# EAGLE design SixPotatoeV6 (EAGLE 9.6.0)
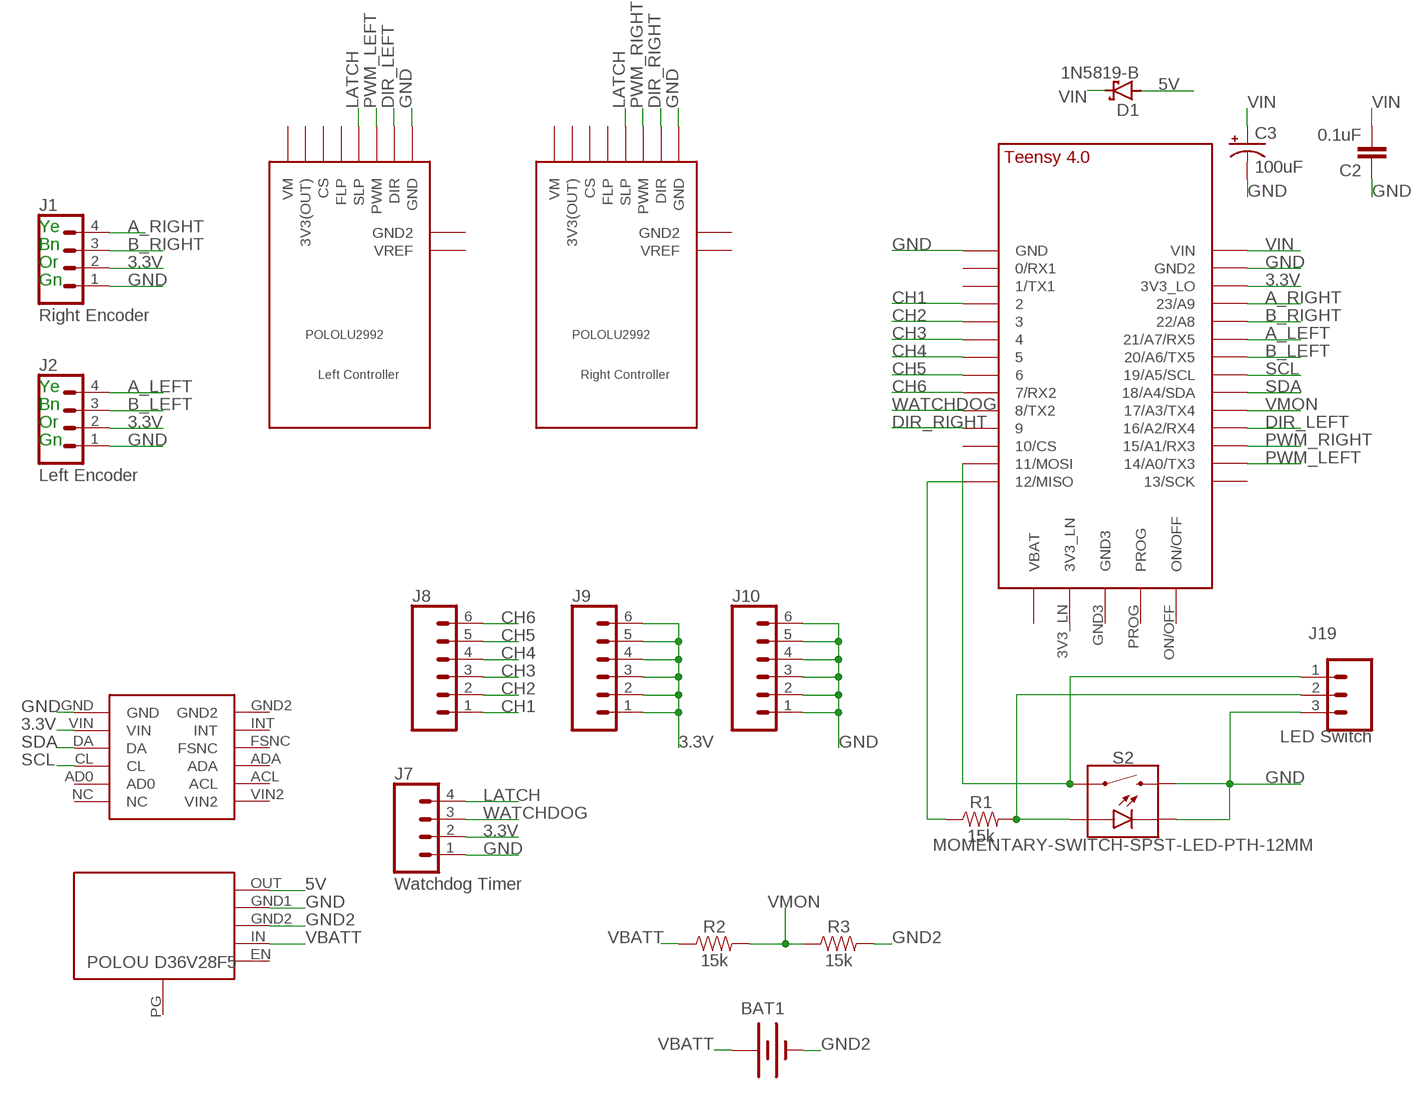
[diagram p0: schematic, sheet 1]

## Parts
BAT1  XT60_MALE  [XT60]
C2  0.1uF  0.1UF-KIT-EZ-50V-20%  [CAP-PTH-SMALL-KIT]
C3  100uF  100UF-POLAR-RADIAL-2.5MM-25V-20%  [CPOL-RADIAL-2.5MM-6.5MM]
D1  1N5819-B  [DO41-7.6]
J1  CONN_04  [1X04]
J2  CONN_04  [1X04]
J7  CONN_04  [1X04]
J8  CONN_06NO_SILK_FEMALE_PTH  [1X06_NO_SILK]
J9  CONN_06NO_SILK_FEMALE_PTH  [1X06_NO_SILK]
J10  CONN_06NO_SILK_FEMALE_PTH  [1X06_NO_SILK]
J19  CONN_03  [1X03]
R1  15k  15KOHM-HORIZ-1/4W-5%  [AXIAL-0.3]
R2  15k  15KOHM-HORIZ-1/4W-5%  [AXIAL-0.3]
R3  15k  15KOHM-HORIZ-1/4W-5%  [AXIAL-0.3]
S2  MOMENTARY-SWITCH-SPST-LED-PTH-12MM  [TACTILE_SWITCH_LED_PTH_12MM]
U$1  TEENSY_4.0  [TEENSY_4.0]
U$2  Left Controller  POLOLU2992_2  [POLOLU2992_2]
U$3  Right Controller  POLOLU2992_2  [POLOLU2992_2]
U$4  POLOU3782  [POLOU3782]
U$5  SEN15335  [SEN15335]

## Nets
3.3V: J1.2 J2.2 J7.2 J9.1 J9.2 J9.3 J9.4 J9.5 J9.6 U$1.3V3_LO U$5.VIN
5V: D1.A U$4.OUT
A_LEFT: J2.4 U$1.21/A7(21/A7/RX5)
A_RIGHT: J1.4 U$1.23/A9
B_LEFT: J2.3 U$1.20/A6(20/A6/TX5)
B_RIGHT: J1.3 U$1.22/A8
CH1: J8.1 U$1.2
CH2: J8.2 U$1.3/CANTX
CH3: J8.3 U$1.4/CANRX
CH4: J8.4 U$1.5
CH5: J8.5 U$1.6
CH6: J8.6 U$1.7(7/RX2)
DIR_LEFT: U$1.16/A2(16/A2/RX4) U$2.DIR
DIR_RIGHT: U$1.9/CS U$3.DIR
GND: C2.1 C3.2(-) J1.1 J2.1 J7.1 J10.1 J10.2 J10.3 J10.4 J10.5 J10.6 J19.3 S2.2 S2.C U$1.GND U$1.GND2 U$2.GND U$3.GND U$4.GND1 U$5.GND
GND2: BAT1.- R3.P$2 U$4.GND2
LATCH: J7.4 U$2.SLP U$3.SLP
N$2: J19.2 R1.P$2 S2.A
N$3: R1.P$1 U$1.12/MISO
N$4: J19.1 S2.4 U$1.11/MOSI
PWM_LEFT: U$1.14/A0(14/A0/TX3) U$2.PWM
PWM_RIGHT: U$1.15/A1(15/A1/RX3) U$3.PWM
SCL: U$1.19/A5/SCL U$5.CL
SDA: U$1.18/A4/SDA U$5.DA
VBATT: BAT1.+ R2.P$1 U$4.IN
VIN: C2.2 C3.1(+) D1.C U$1.VIN
VMON: R2.P$2 R3.P$1 U$1.17/A3(17/A3/TX4)
WATCHDOG: J7.3 U$1.8(8/TX2)
Unconnected: U$1.0/RX(0/RX1) U$1.1/TX(1/TX1) U$1.3V3_LN U$1.10/CS U$1.13/SCK U$1.GND3 U$1.ON/OFF U$1.PROG U$1.VBAT\(VBAT) U$2.3V3(OUT) U$2.CS U$2.FLP U$2.GND2 U$2.VM U$2.VREF U$3.3V3(OUT) U$3.CS U$3.FLP U$3.GND2 U$3.VM U$3.VREF U$4.EN U$4.PG U$5.ACL U$5.AD0 U$5.ADA U$5.FSNC U$5.GND2 U$5.INT U$5.NC U$5.VIN2

## Notes on the sheet
- Ye
- Bn
- Or
- Gn
- Ye
- Bn
- Or
- Gn

## Library data of the parts
BAT1 = Tristan+Robitaille's+Library:XT60_MALE: Vertical Mount Through-Hole Male (for female battery) XT60 Connector
C2 = SparkFun-Capacitors:0.1UF: 0.1µF ceramic capacitors A capacitor is a passive two-terminal electrical component used to store electrical energy temporarily in an electric field.; PROD_ID: CAP-08370
C3 = SparkFun-Capacitors:100UF-POLAR: 100µF polarized capacitors A capacitor is a passive two-terminal electrical component used to store electrical energy temporarily in an electric field.; PROD_ID: CAP-08439
D1 = diode:1N581*: 1.0A SCHOTTKY BARRIER RECTIFIER Source: http://www.diodes.com/datasheets/ds23001.pdf
J1 = SparkFun-Connectors:CONN_04: Multi connection point. Often used as Generic Header-pin footprint for 0.1 inch spaced/style header connections On any of the 0.1 inch spaced packages, you can populate with these: Break Away Headers - Straight <https://www.sparkfun.com/products/116> (PRT-00116) Break Away Male Headers - Right Angle <https://www.sparkfun.com/products/553> (PRT-00553) Female Headers <https://www.sparkfun.com/products/115> (PRT-00115) Break Away Headers - Machine Pin <https://www.sparkfun.com/products/117> (PRT-00117) Break Away Female Headers - Swiss Machine Pin <https://www.sparkfun.com/products/743> (PRT-00743) For SCREWTERMINALS and SPRING TERMINALS visit here: Screw Terimnals on SparkFun.com <https://www.sparkfun.com/search/results?term=Screw+Terminals> (5mm/3.5mm/2.54mm spacing) This device is also useful as a general connection point to wire up your design to another part of your project. Our various solder wires solder well into these plated through hole pads. Hook-Up Wire - Assortment (Stranded, 22 AWG) <https://www.sparkfun.com/products/11375> (PRT-11375) Hook-Up Wire - Assortment (Solid Core, 22 AWG) <https://www.sparkfun.com/products/11367> (PRT-11367) View the entire wire category on our website here <https://www.sparkfun.com/categories/141> Special notes: Molex polarized connector foot print use with SKU : PRT-08231 with associated crimp pins and housings. 1MM SMD Version SKU: PRT-10208; ID: Right Encoder; PROD_ID: CONN-09696
J2 = SparkFun-Connectors:CONN_04: Multi connection point. Often used as Generic Header-pin footprint for 0.1 inch spaced/style header connections On any of the 0.1 inch spaced packages, you can populate with these: Break Away Headers - Straight <https://www.sparkfun.com/products/116> (PRT-00116) Break Away Male Headers - Right Angle <https://www.sparkfun.com/products/553> (PRT-00553) Female Headers <https://www.sparkfun.com/products/115> (PRT-00115) Break Away Headers - Machine Pin <https://www.sparkfun.com/products/117> (PRT-00117) Break Away Female Headers - Swiss Machine Pin <https://www.sparkfun.com/products/743> (PRT-00743) For SCREWTERMINALS and SPRING TERMINALS visit here: Screw Terimnals on SparkFun.com <https://www.sparkfun.com/search/results?term=Screw+Terminals> (5mm/3.5mm/2.54mm spacing) This device is also useful as a general connection point to wire up your design to another part of your project. Our various solder wires solder well into these plated through hole pads. Hook-Up Wire - Assortment (Stranded, 22 AWG) <https://www.sparkfun.com/products/11375> (PRT-11375) Hook-Up Wire - Assortment (Solid Core, 22 AWG) <https://www.sparkfun.com/products/11367> (PRT-11367) View the entire wire category on our website here <https://www.sparkfun.com/categories/141> Special notes: Molex polarized connector foot print use with SKU : PRT-08231 with associated crimp pins and housings. 1MM SMD Version SKU: PRT-10208; ID: Left Encoder; PROD_ID: CONN-09696
J7 = SparkFun-Connectors:CONN_04: Multi connection point. Often used as Generic Header-pin footprint for 0.1 inch spaced/style header connections On any of the 0.1 inch spaced packages, you can populate with these: Break Away Headers - Straight <https://www.sparkfun.com/products/116> (PRT-00116) Break Away Male Headers - Right Angle <https://www.sparkfun.com/products/553> (PRT-00553) Female Headers <https://www.sparkfun.com/products/115> (PRT-00115) Break Away Headers - Machine Pin <https://www.sparkfun.com/products/117> (PRT-00117) Break Away Female Headers - Swiss Machine Pin <https://www.sparkfun.com/products/743> (PRT-00743) For SCREWTERMINALS and SPRING TERMINALS visit here: Screw Terimnals on SparkFun.com <https://www.sparkfun.com/search/results?term=Screw+Terminals> (5mm/3.5mm/2.54mm spacing) This device is also useful as a general connection point to wire up your design to another part of your project. Our various solder wires solder well into these plated through hole pads. Hook-Up Wire - Assortment (Stranded, 22 AWG) <https://www.sparkfun.com/products/11375> (PRT-11375) Hook-Up Wire - Assortment (Solid Core, 22 AWG) <https://www.sparkfun.com/products/11367> (PRT-11367) View the entire wire category on our website here <https://www.sparkfun.com/categories/141> Special notes: Molex polarized connector foot print use with SKU : PRT-08231 with associated crimp pins and housings. 1MM SMD Version SKU: PRT-10208; ID: Watchdog Timer; PROD_ID: CONN-09696
J8-J10 = SparkFun-Connectors:CONN_06: Multi connection point. Often used as Generic Header-pin footprint for 0.1 inch spaced/style header connections On any of the 0.1 inch spaced packages, you can populate with these: Break Away Headers - Straight <https://www.sparkfun.com/products/116> (PRT-00116) Break Away Male Headers - Right Angle <https://www.sparkfun.com/products/553> (PRT-00553) Female Headers <https://www.sparkfun.com/products/115> (PRT-00115) Break Away Headers - Machine Pin <https://www.sparkfun.com/products/117> (PRT-00117) Break Away Female Headers - Swiss Machine Pin <https://www.sparkfun.com/products/743> (PRT-00743) Arduino Stackable Header - 6 Pin <https://www.sparkfun.com/products/9280> (PRT-09280) For SCREWTERMINALS and SPRING TERMINALS visit here: Screw Terimnals on SparkFun.com <https://www.sparkfun.com/search/results?term=Screw+Terminals> (5mm/3.5mm/2.54mm spacing) This device is also useful as a general connection point to wire up your design to another part of your project. Our various solder wires solder well into these plated through hole pads. Hook-Up Wire - Assortment (Stranded, 22 AWG) <https://www.sparkfun.com/products/11375> (PRT-11375) Hook-Up Wire - Assortment (Solid Core, 22 AWG) <https://www.sparkfun.com/products/11367> (PRT-11367) View the entire wire category on our website here <https://www.sparkfun.com/categories/141>; PROD_ID: CONN-08437
J19 = SparkFun-Connectors:CONN_03: Multi connection point. Often used as Generic Header-pin footprint for 0.1 inch spaced/style header connections On any of the 0.1 inch spaced packages, you can populate with these: Break Away Headers - Straight <https://www.sparkfun.com/products/116> (PRT-00116) Break Away Male Headers - Right Angle <https://www.sparkfun.com/products/553> (PRT-00553) Female Headers <https://www.sparkfun.com/products/115> (PRT-00115) Break Away Headers - Machine Pin <https://www.sparkfun.com/products/117> (PRT-00117) Break Away Female Headers - Swiss Machine Pin <https://www.sparkfun.com/products/743> (PRT-00743) Stackable Header - 3 Pin (Female, 0.1") <https://www.sparkfun.com/products/13875> (PRT-13875) For SCREWTERMINALS and SPRING TERMINALS visit here: Screw Terimnals on SparkFun.com <https://www.sparkfun.com/search/results?term=Screw+Terminals> (5mm/3.5mm/2.54mm spacing) This device is also useful as a general connection point to wire up your design to another part of your project. Our various solder wires solder well into these plated through hole pads. Hook-Up Wire - Assortment (Stranded, 22 AWG) <https://www.sparkfun.com/products/11375> (PRT-11375) Hook-Up Wire - Assortment (Solid Core, 22 AWG) <https://www.sparkfun.com/products/11367> (PRT-11367) View the entire wire category on our website here <https://www.sparkfun.com/categories/141> Special notes: Molex polarized connector foot print use with SKU : PRT-08232 with associated crimp pins and housings.; ID: LED Switch
R1-R3 = SparkFun-Resistors:15KOHM: 15kΩ resistor A resistor is a passive two-terminal electrical component that implements electrical resistance as a circuit element. Resistors act to reduce current flow, and, at the same time, act to lower voltage levels within circuits. - Wikipedia; PROD_ID: RES-11360
S2 = TimEagleLibrary:MOMENTARY-SWITCH-SPST-LED: Momentary Switch (Pushbutton) - SPST - w/ LED Normally-open (NO) SPST momentary switches (buttons, pushbuttons), with a built-in LED. Variants PTH-CHERRY - Cherry MX Switch Cherry MX Keyswitches are top-of-the-line mechanical keyboard switches. They’re satisfyingly “clicky”, reliable up to tens-of-millions of key presses, and a standard in gaming and programming keyboards across the globe. This ‘blue’ version Cherry MX Switch is favored by most due to its secondary internal actuator making it less likely to “double-tap.” If you are looking for a noticeably audible and high-quality key switch, this is the perfect option for you! Cherry MX Switch <https://www.sparkfun.com/products/13834> (COM-13834) Cherry MX Switch Breakout <https://www.sparkfun.com/products/13773> (BOB-13773) PTH-12MM and PTH-12MM-KIT - 12mm Illuminated LED KIT variant is for soldering kits. There is no tStop (covering up the top side of the pads with mask). This helps the beginner see which side they should be soldering too. LED Tactile Button Breakout <https://www.sparkfun.com/products/10467> (BOB-10467) LED Tactile Button - Red <https://www.sparkfun.com/products/10442> (COM-10442) LED Tactile Button - Blue <https://www.sparkfun.com/products/10443> (COM-10443) LED Tactile Button - Green <https://www.sparkfun.com/products/10440> (COM-10440) LED Tactile Button - Orange <https://www.sparkfun.com/products/10441> (COM-10441) LED Tactile Button - White <https://www.sparkfun.com/products/10439> (COM-10439); PROD_ID: SWCH-11758; SF_SKU: COM-10442
U$1 = TEENSY 4.0:TEENSY_4.0
U$2 U$3 = TimEagleLibrary:POLOLU2992_2
U$4 = TimEagleLibrary:POLOU3782
U$5 = TimEagleLibrary:SEN15335

## Board
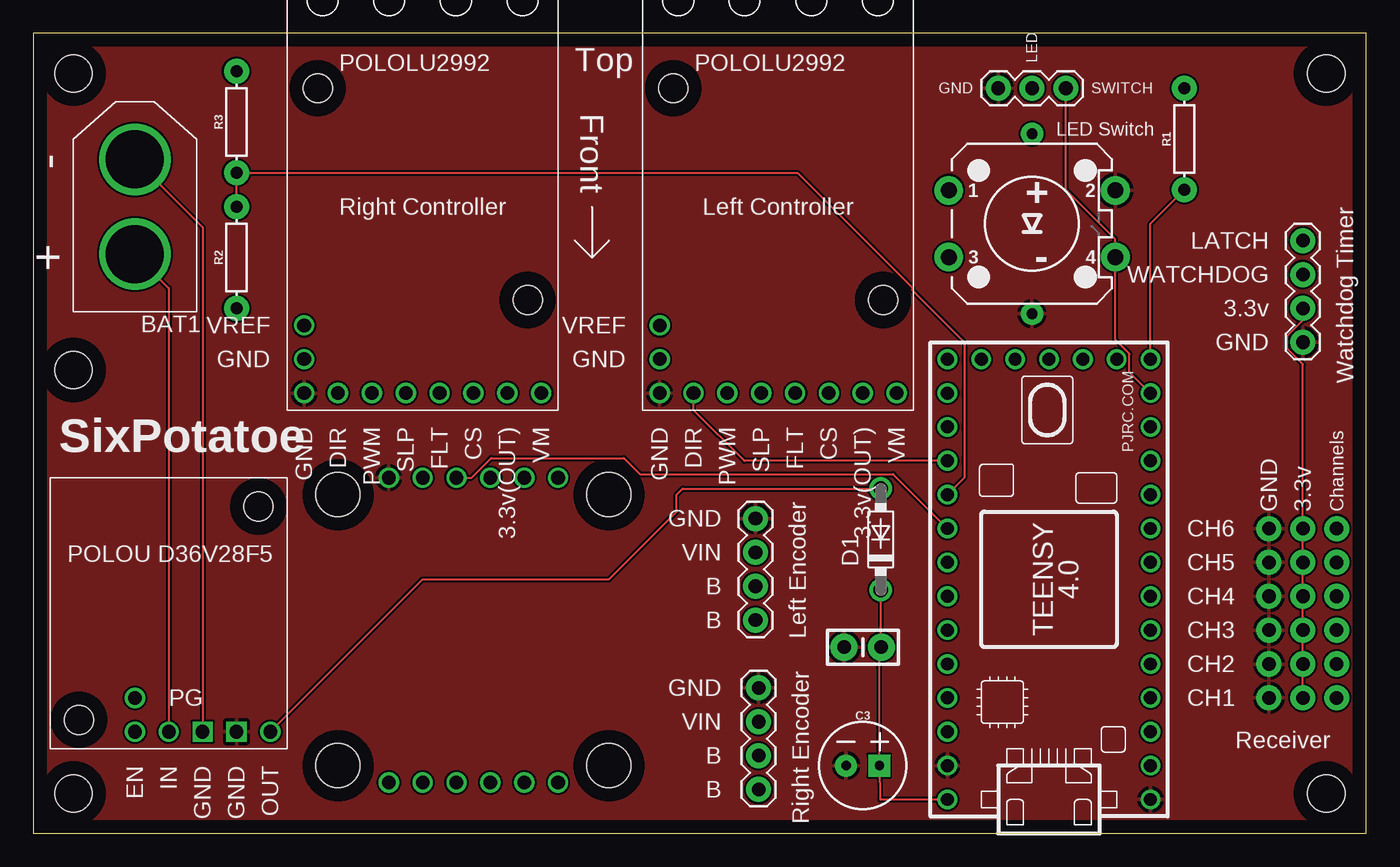
[diagram p1: board, top side]
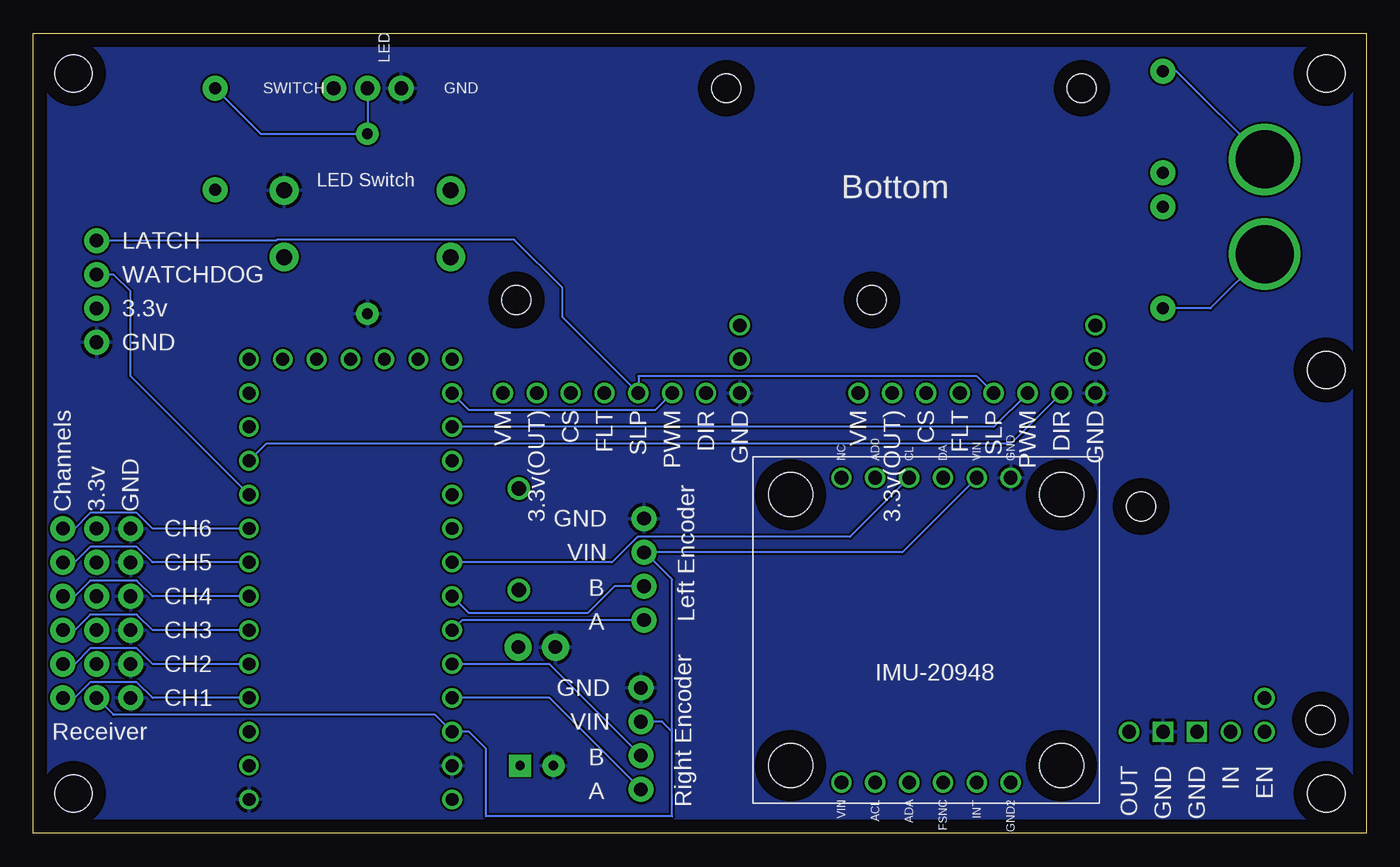
[diagram p2: board, bottom side, seen from below]

Size 100 x 60 mm. Coordinates in mm from the lower left corner, seen from the top.
Outline: 0,0 100,0 100,60 0,60 0,0
Copper layers (1*16): Top 0.035mm / dielectric 1.5mm / Bottom 0.035mm
Design rules "default": minimum track width 6mil, minimum drill 0.35mm, track to track 6mil, track to pad 6mil, pad to pad 6mil, via to via 6mil, smd to smd 6mil, copper to edge 40mil, drill to drill 6mil, minimum pad ring 10mil, minimum via ring 8mil, stop-mask expansion 4mil, vias tented up to drill 0mil, thermal gap 10mil
Holes 2.8 mm at 97,57 97,3 3,3 3,57 3,34.75

### Footprints (pad centres in the part's own frame; a part is rotated, then mirrored left to right if it is on the bottom)
XT60 = drill 4.35: + 3.55,0; - -3.55,0
CAP-PTH-SMALL-KIT = drill 1.016 pad 2.032: 1 -1.397,0; 2 1.397,0
CPOL-RADIAL-2.5MM-6.5MM = drill 0.7 pad 1.651 square: 1 1.25,0 | drill 0.7 pad 1.651: 2 -1.25,0
DO41-7.6 = drill 1.1 pad 1.7: A 3.81,0; C -3.81,0
1X04 = drill 1.016 pad 1.88: 1 0,0; 2 2.54,0; 3 5.08,0; 4 7.62,0
1X06_NO_SILK = drill 1.016 pad 1.88: 1 0,0; 2 2.54,0; 3 5.08,0; 4 7.62,0; 5 10.16,0; 6 12.7,0
1X03 = drill 1.016 pad 1.88: 1 0,0; 2 2.54,0; 3 5.08,0
AXIAL-0.3 = drill 0.9 pad 1.88: P$1 -3.81,0; P$2 3.81,0
TACTILE_SWITCH_LED_PTH_12MM = drill 1.2 pad 2.159: 1 -6.25,2.5; 2 6.25,2.5; 3 -6.25,-2.5; 4 6.25,-2.5 | drill 0.8 pad 1.676: A 0,6.75; C 0,-6.75
TEENSY_4.0 = drill 0.965: 0/RX -13.97,-7.62; 1/TX -11.43,-7.62; 2 -8.89,-7.62; 3/CANTX -6.35,-7.62; 3V3_LN 16.51,-2.54; 3V3_LO -11.43,7.62; 4/CANRX -3.81,-7.62; 5 -1.27,-7.62; 6 1.27,-7.62; 7 3.81,-7.62; 8 6.35,-7.62; 9/CS 8.89,-7.62; 10/CS 11.43,-7.62; 11/MOSI 13.97,-7.62; 12/MISO 16.51,-7.62; 13/SCK 16.51,7.62; 14/A0 13.97,7.62; 15/A1 11.43,7.62; 16/A2 8.89,7.62; 17/A3 6.35,7.62; 18/A4/SDA 3.81,7.62; 19/A5/SCL 1.27,7.62; 20/A6 -1.27,7.62; 21/A7 -3.81,7.62; 22/A8 -6.35,7.62; 23/A9 -8.89,7.62; GND -16.51,-7.62; GND2 -13.97,7.62; GND3 16.51,0; ON/OFF 16.51,5.08; PROG 16.51,2.54; VBAT\ 16.51,-5.08; VIN -16.51,7.62
POLOLU2992_2 = drill 1.016: 3V3(OUT) 3.81,31.75; CS 6.35,31.75; DIR 16.51,31.75; FLP 8.89,31.75; GND 19.05,31.75; GND2 19.05,29.21; PWM 13.97,31.75; SLP 11.43,31.75; VM 1.27,31.75; VREF 19.05,26.67 | hole 2.184: 2.286,24.765; 18.034,8.89
POLOU3782 = drill 1.016: EN -2.54,-7.62; IN 0,-7.62; OUT 7.62,-7.62; PG -2.54,-5.08 | drill 1.016 square: GND1 5.08,-7.62; GND2 2.54,-7.62 | hole 2.184: -6.731,-6.731; 6.731,9.271
SEN15335 = drill 1.016: ACL 11.43,-3.81; AD0 -11.43,-3.81; ADA 11.43,-1.27; CL -11.43,-1.27; DA -11.43,1.27; FSNC 11.43,1.27; GND -11.43,6.35; GND2 11.43,6.35; INT 11.43,3.81; NC -11.43,-6.35; VIN -11.43,3.81; VIN2 11.43,-6.35 | hole 3.302: -10.16,10.16; 10.16,10.16; 10.16,-10.16; -10.16,-10.16

### Placement (x,y rotation side)
BAT1  7.62,46.99 270 top
C2  62.23,13.97 0 top
C3  62.23,5.08 0 top
D1  63.58,22.05 90 top
J1  54.41,10.91 270 top
J2  54.18,23.61 270 top
J7  95.25,36.83 90 top
J8  97.79,10.16 90 top
J9  95.25,10.16 90 top
J10  92.71,10.16 90 top
J19  77.47,55.88 180 top
R1  86.36,52.07 90 top
R2  15.24,43.18 90 top
R3  15.24,53.34 90 top
S2  74.93,45.72 0 top
U$1  76.2,19.05 90 top
U$2  66.04,64.77 180 top
U$3  39.37,64.77 180 top
U$4  10.16,15.24 0 top
U$5  33.02,15.24 270 bottom

### Tracks (layer width: path | path; a pad name or v marks a point on that pad's centre or on a via)
3.3V
  Top 0.152: J9.1 J9.2 J9.3 J9.4 J9.5 J9.6 95.25,35.18 94.08,36.35 94.08,37.31 95.25,38.48 J7.2
  Bottom 0.152: 52.07,7.62 52.07,1.27 66.04,1.27 66.04,6.35 67.31,7.62 U$1.3V3_LO 69.85,8.89 93.98,8.89 J9.1 | 52.07,7.62 52.82,8.37 J1.2 | 52.07,7.62 52.07,19.05 54.09,21.07 J2.2 34.81,21.07 U$5.VIN
5V
  Top 0.152: U$4.OUT 29.21,19.05 43.18,19.05 48.26,24.13 48.26,25.4 48.72,25.86 D1.A
A_LEFT
  Bottom 0.152: J2.4 67.83,15.99 U$1.21/A7
A_RIGHT
  Bottom 0.152: J1.4 61.28,10.16 U$1.23/A9
B_LEFT
  Bottom 0.152: J2.3 56.4,18.53 58.42,16.51 67.31,16.51 U$1.20/A6
B_RIGHT
  Bottom 0.152: J1.3 61.28,12.7 U$1.22/A8
CH1
  Bottom 0.152: U$1.2 91.06,10.16 92.23,11.33 95.73,11.33 96.9,10.16 J8.1
CH2
  Bottom 0.152: U$1.3/CANTX 91.06,12.7 92.23,13.87 95.73,13.87 96.9,12.7 J8.2
CH3
  Bottom 0.152: U$1.4/CANRX 91.06,15.24 92.23,16.41 95.73,16.41 96.9,15.24 J8.3
CH4
  Bottom 0.152: U$1.5 91.06,17.78 92.23,18.95 95.73,18.95 96.9,17.78 J8.4
CH5
  Bottom 0.152: U$1.6 91.06,20.32 92.23,21.49 95.73,21.49 96.9,20.32 J8.5
CH6
  Bottom 0.152: U$1.7 91.06,22.86 92.23,24.03 95.73,24.03 96.9,22.86 J8.6
DIR_LEFT
  Top 0.152: U$1.16/A2 53.34,27.94 49.53,31.75 U$2.DIR
DIR_RIGHT
  Bottom 0.152: U$3.DIR 26.67,29.21 82.55,29.21 U$1.9/CS
GND
  pour Bottom: 0,59.69 99.06,59.69 99.06,0 0,0
  pour Top: 0,59.69 99.06,59.69 99.06,0 0,0
GND2
  Top 0.152: BAT1.- 12.7,45.46 U$4.GND2
  Bottom 0.152: BAT1.- 14.23,57.15 R3.P$2
LATCH
  Bottom 0.152: U$3.SLP 29.21,34.29 54.61,34.29 U$2.SLP 60.3,38.71 60.3,40.91 63.92,44.53 81.72,44.53 81.8,44.45 J7.4
N$2
  Bottom 0.152: R1.P$2 82.95,52.47 S2.A J19.2
N$3
  Top 0.152: U$1.12/MISO 83.82,45.72 R1.P$1
N$4
  Top 0.152: U$1.11/MOSI 82.25,34.59 82.25,35.96 81.18,37.02 S2.4 81.18,44.55 77.47,48.26 J19.1
PWM_LEFT
  Bottom 0.152: U$2.PWM 53.34,31.75 67.31,31.75 U$1.14/A0
PWM_RIGHT
  Bottom 0.152: U$3.PWM 27.94,30.48 U$1.15/A1
SCL
  Bottom 0.152: U$1.19/A5/SCL 56.58,20.32 54.66,22.24 38.72,22.24 U$5.CL
SDA
  Top 0.152: U$5.DA 32.89,26.67 34.36,28.14 44.32,28.14 45.52,26.94 64.5,26.94 U$1.18/A4/SDA
VBATT
  Top 0.152: BAT1.+ 10.16,40.9 U$4.IN
  Bottom 0.152: BAT1.+ 11.69,39.37 R2.P$1
VIN
  Top 0.152: U$1.VIN 63.52,2.54 C3.1 63.48,13.82 C2.2 63.58,14.02 D1.C
VMON
  Top 0.152: R2.P$2 R3.P$1 57.32,49.53 65.94,40.91 65.94,40.74 69.85,36.83 69.85,26.67 U$1.17/A3
WATCHDOG
  Bottom 0.152: U$1.8 92.71,34.29 92.71,40.64 93.98,41.91 J7.3

### Text on the board
tPlace: LED | Top | GND | SWITCH | Front | LED Switch | Watchdog Timer | LATCH | WATCHDOG | 3.3v | GND | SixPotatoe | Left Encoder | GND | GND | 3.3v | Channels | CH6 | VIN | CH5 | B | CH4 | B | CH3 | CH2 | Right Encoder | GND | PG | CH1 | VIN | B | Receiver | EN | IN | GND | GND | OUT | B
bPlace: LED | GND | SWITCH | LED Switch | Bottom | LATCH | WATCHDOG | 3.3v | GND | GND | DIR | PWM | SLP | FLT | CS | 3.3v(OUT) | VM | GND | DIR | PWM | SLP | FLT | CS | 3.3v(OUT) | VM | Left Encoder | GND | GND | 3.3v | Channels | CH6 | VIN | CH5 | B | CH4 | A | CH3 | Right Encoder | CH2 | IMU-20948 | GND | CH1 | VIN | Receiver | B | EN | IN | GND | GND | OUT | A